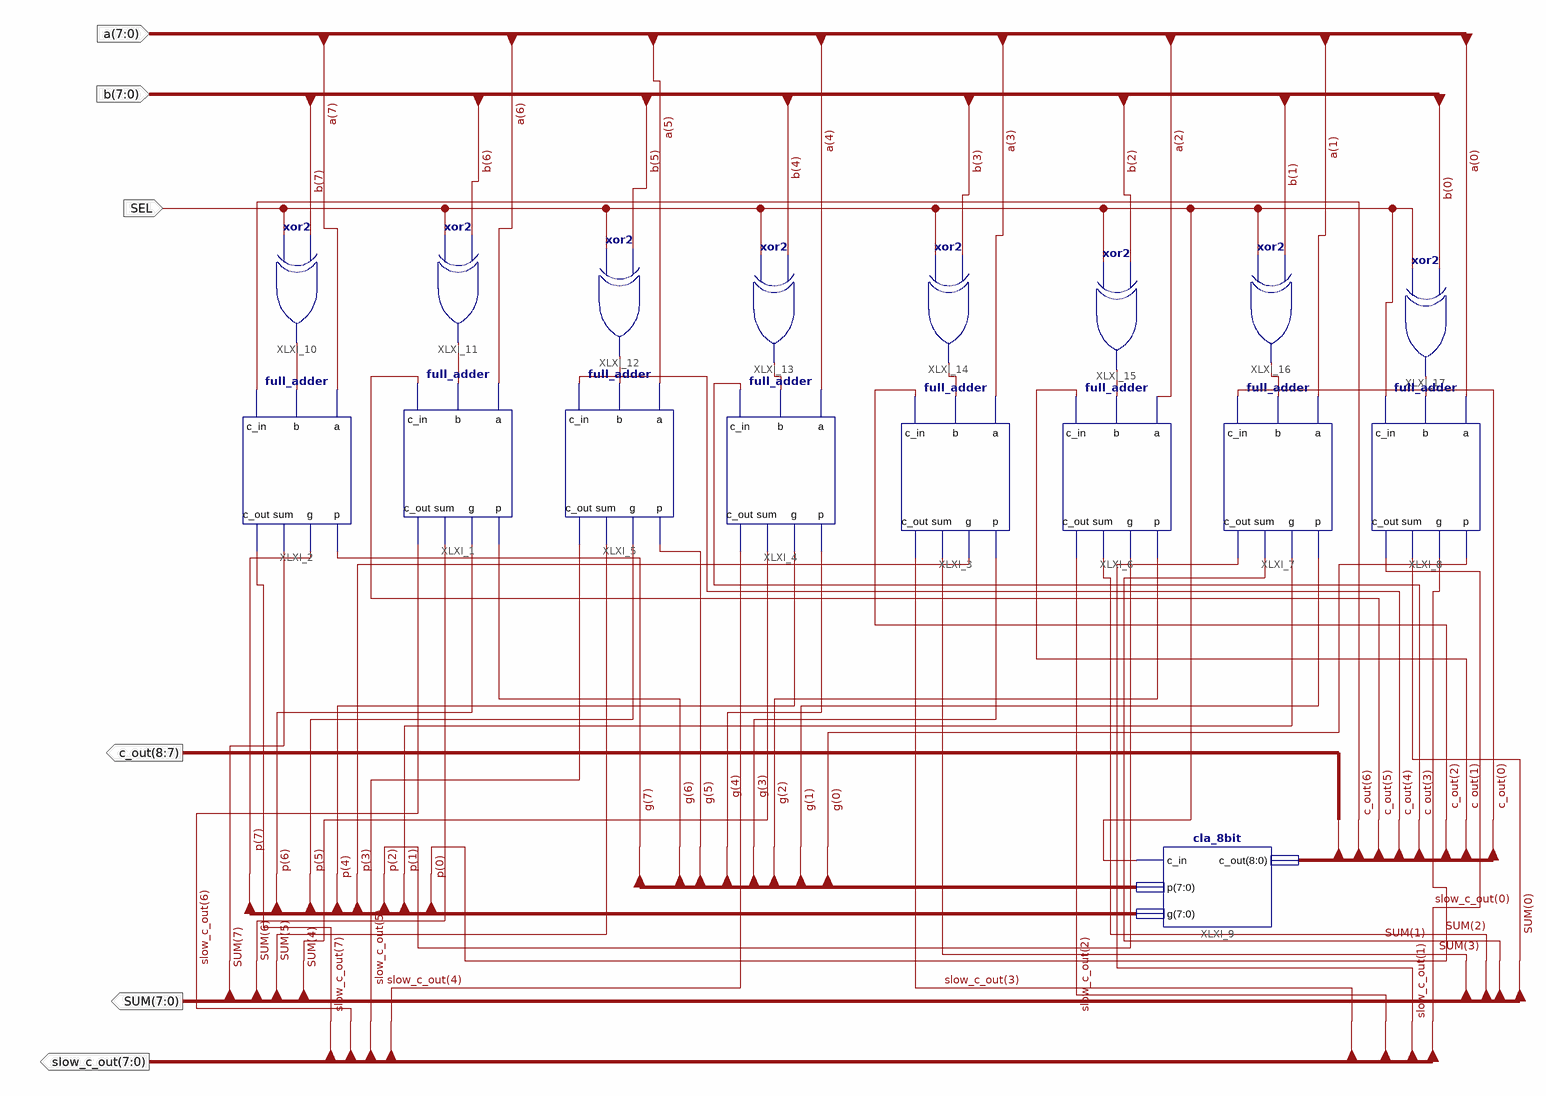
[diagram p0: schematic sheet 1]
// Xilinx ISE schematic fa_cla_8bit.sch (spartan3e) as structural Verilog: 17 symbols, 6 ports
module fa_cla_8bit (
  input  [7:0] a,
  input  [7:0] b,
  input  SEL,
  output [8:0] c_out,
  output [7:0] SUM,
  output [7:0] slow_c_out
);

  wire XLXN_29, XLXN_30, XLXN_31, XLXN_32, XLXN_33, XLXN_34, XLXN_35, XLXN_36;
  wire [7:0] g, p, XLXN_38, XLXN_39;
  wire [8:0] XLXN_107;

  full_adder XLXI_1 (.a(a[6]), .b(XLXN_30), .c_in(c_out[5]), .p(g[6]), .g(p[6]), .sum(SUM[6]), .c_out(slow_c_out[6]));
  full_adder XLXI_2 (.a(a[7]), .b(XLXN_29), .c_in(c_out[6]), .p(g[7]), .g(p[7]), .sum(SUM[7]), .c_out(slow_c_out[7]));
  full_adder XLXI_3 (.a(a[3]), .b(XLXN_33), .c_in(c_out[2]), .p(g[3]), .g(p[3]), .sum(SUM[3]), .c_out(slow_c_out[3]));
  full_adder XLXI_4 (.a(a[4]), .b(XLXN_32), .c_in(c_out[3]), .p(g[4]), .g(p[4]), .sum(SUM[4]), .c_out(slow_c_out[4]));
  full_adder XLXI_5 (.a(a[5]), .b(XLXN_31), .c_in(c_out[4]), .p(g[5]), .g(p[5]), .sum(SUM[5]), .c_out(slow_c_out[5]));
  full_adder XLXI_6 (.a(a[2]), .b(XLXN_34), .c_in(c_out[1]), .p(g[2]), .g(p[2]), .sum(SUM[2]), .c_out(slow_c_out[2]));
  full_adder XLXI_7 (.a(a[1]), .b(XLXN_35), .c_in(c_out[0]), .p(g[1]), .g(p[1]), .sum(SUM[1]), .c_out(slow_c_out[1]));
  full_adder XLXI_8 (.a(a[0]), .b(XLXN_36), .c_in(SEL), .p(g[0]), .g(p[0]), .sum(SUM[0]), .c_out(slow_c_out[0]));
  xor XLXI_10 (XLXN_29, SEL, b[7]);
  xor XLXI_11 (XLXN_30, SEL, b[6]);
  xor XLXI_12 (XLXN_31, SEL, b[5]);
  xor XLXI_13 (XLXN_32, SEL, b[4]);
  xor XLXI_14 (XLXN_33, SEL, b[3]);
  xor XLXI_15 (XLXN_34, SEL, b[2]);
  xor XLXI_16 (XLXN_35, SEL, b[1]);
  xor XLXI_17 (XLXN_36, SEL, b[0]);
  cla_8bit XLXI_9 (.c_in(SEL), .p(XLXN_38), .g(XLXN_39), .c_out(XLXN_107));
endmodule
